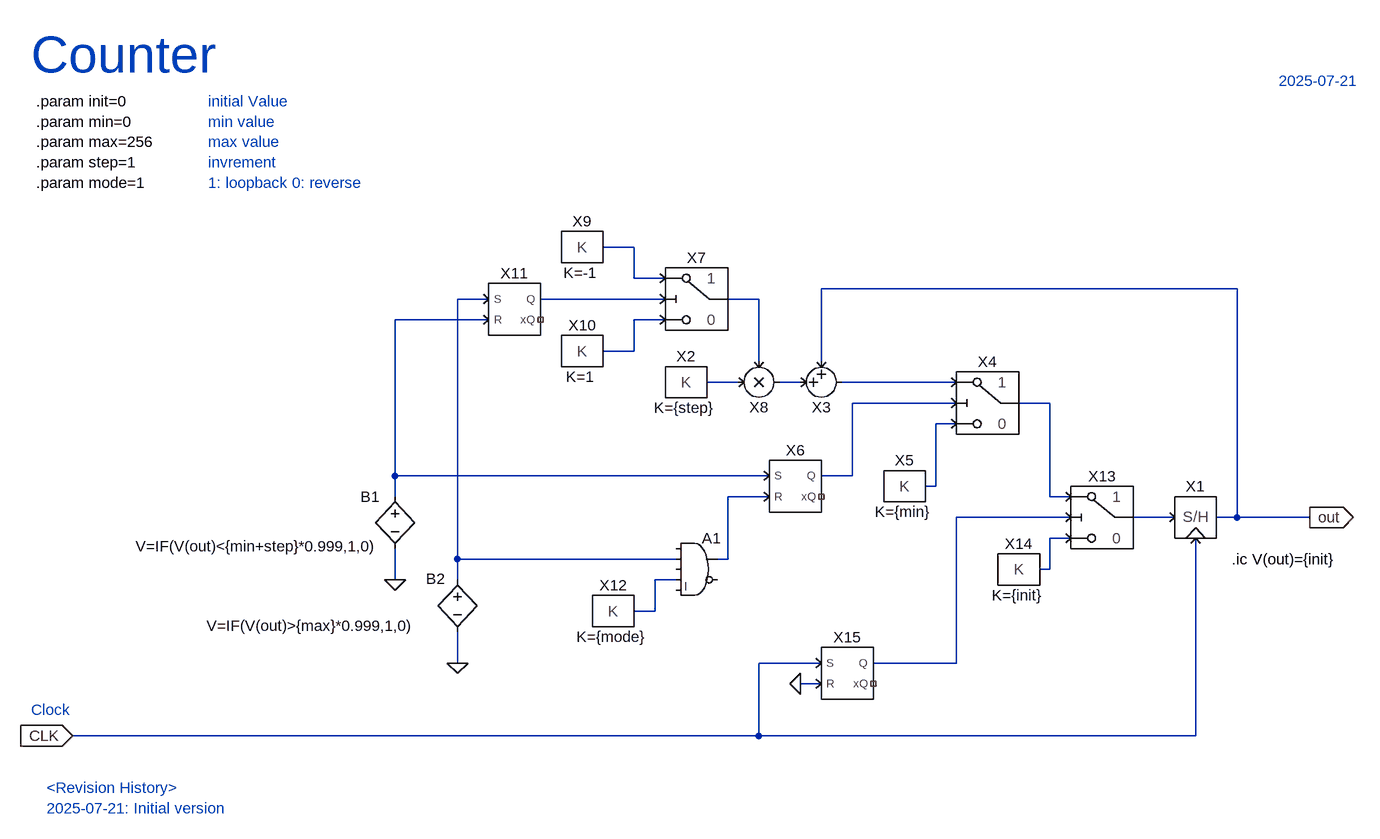
[diagram p0: schematic COUNTER.asc]
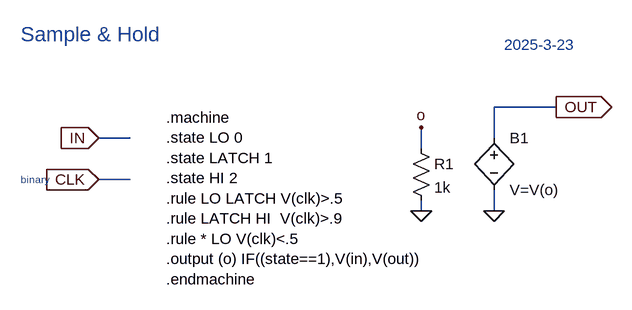
[diagram p1: sub-circuit samplehold.asc]
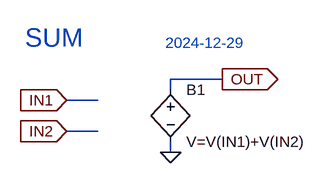
[diagram p2: sub-circuit sum.asc]
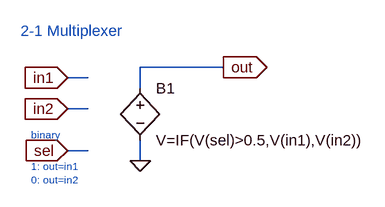
[diagram p3: sub-circuit mux.asc]
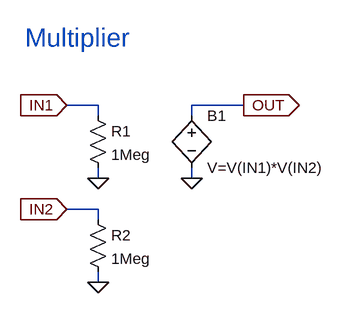
[diagram p4: sub-circuit mul.asc]
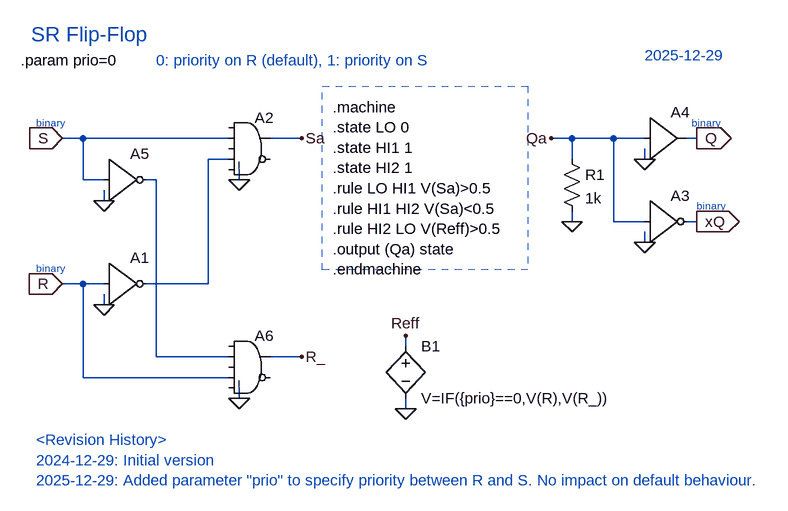
[diagram p5: sub-circuit srff.asc]
COUNTER.asc, the LTspice schematic file:
Version 4.1
SHEET 1 2588 2296
WIRE 160 304 112 304
WIRE 160 352 160 304
WIRE 208 352 160 352
WIRE 1088 368 448 368
WIRE -64 384 -112 384
WIRE 208 384 16 384
WIRE 352 384 304 384
WIRE -64 416 -208 416
WIRE 208 416 160 416
WIRE 160 464 160 416
WIRE 160 464 112 464
WIRE 352 480 352 384
WIRE 448 480 448 368
WIRE 320 512 272 512
WIRE 416 512 384 512
WIRE 656 512 480 512
WIRE 656 544 496 544
WIRE 800 544 752 544
WIRE 656 576 624 576
WIRE -208 656 -208 416
WIRE 368 656 -208 656
WIRE 496 656 496 544
WIRE 496 656 448 656
WIRE 624 672 624 576
WIRE 624 672 608 672
WIRE -208 688 -208 656
WIRE 368 688 304 688
WIRE 800 688 800 544
WIRE 832 688 800 688
WIRE 832 720 656 720
WIRE 992 720 928 720
WIRE 1088 720 1088 368
WIRE 1088 720 1056 720
WIRE 1200 720 1088 720
WIRE 832 752 800 752
WIRE -112 784 -112 384
WIRE 224 784 -112 784
WIRE 304 784 304 688
WIRE 304 784 288 784
WIRE 800 800 800 752
WIRE 800 800 784 800
WIRE -208 816 -208 768
WIRE -112 816 -112 784
WIRE 224 816 192 816
WIRE 192 864 192 816
WIRE 192 864 160 864
WIRE -112 944 -112 896
WIRE 448 944 352 944
WIRE 656 944 656 720
WIRE 656 944 528 944
WIRE 448 976 416 976
WIRE 352 1056 352 944
WIRE 352 1056 -704 1056
WIRE 1024 1056 1024 752
WIRE 1024 1056 352 1056
FLAG -704 1056 CLK
IOPIN -704 1056 In
FLAG 1200 720 out
IOPIN 1200 720 Out
FLAG -208 816 0
FLAG -112 944 0
FLAG 416 976 0
SYMBOL SAMPLEHOLD 1024 720 R0
SYMATTR InstName X1
SYMBOL CONST 240 512 R0
WINDOW 39 -3 55 Bottom 2
SYMATTR SpiceLine K={step}
SYMATTR InstName X2
SYMBOL SUM 448 512 M180
SYMATTR InstName X3
SYMBOL MUX 704 544 R0
SYMATTR InstName X4
SYMBOL CONST 576 672 R0
WINDOW 39 -3 55 Bottom 2
SYMATTR SpiceLine K={min}
SYMATTR InstName X5
SYMBOL bv -208 672 M0
WINDOW 3 25 92 Left 2
SYMATTR Value V=IF(V(out)<{min+step}*0.999,1,0)
SYMATTR InstName B1
SYMBOL bv -112 800 R0
WINDOW 0 -48 14 Left 2
WINDOW 3 -386 87 Left 2
SYMATTR InstName B2
SYMATTR Value V=IF(V(out)>{max}*0.999,1,0)
SYMBOL MUX 256 384 R0
SYMATTR InstName X7
SYMBOL MUL 352 512 M180
SYMATTR InstName X8
SYMBOL CONST 80 304 R0
WINDOW 39 -3 55 Bottom 2
SYMATTR SpiceLine K=-1
SYMATTR InstName X9
SYMBOL CONST 80 464 R0
WINDOW 39 -3 55 Bottom 2
SYMATTR InstName X10
SYMBOL SRFF -32 400 R0
SYMATTR InstName X11
SYMBOL SRFF 400 672 R0
SYMATTR InstName X6
SYMBOL Digital\\and 256 736 R0
SYMATTR InstName A1
SYMBOL CONST 128 864 R0
WINDOW 39 -3 55 Bottom 2
SYMATTR SpiceLine K={mode}
SYMATTR InstName X12
SYMBOL MUX 880 720 R0
SYMATTR InstName X13
SYMBOL CONST 752 800 R0
WINDOW 39 -3 55 Bottom 2
SYMATTR SpiceLine K={init}
SYMATTR InstName X14
SYMBOL SRFF 480 960 R0
SYMATTR InstName X15
TEXT -760 80 Left 2 !.param init=0\n.param min=0\n.param max=256\n.param step=1\n.param mode=1
TEXT -768 8 Left 6 ;Counter
TEXT 1152 48 Left 2 ;2025-07-21
TEXT 1080 784 Left 2 !.ic V(out)={init}
TEXT -496 80 Left 2 ;initial Value\nmin value\nmax value\ninvrement\n1: loopback 0: reverse
TEXT -768 1016 Left 2 ;Clock
TEXT -744 1136 Left 2 ;<Revision History>\n2025-07-21: Initial version

samplehold.asc, the sub-circuit schematic file:
Version 4
SHEET 1 880 680
WIRE 576 -560 480 -560
WIRE -80 -512 -128 -512
WIRE 480 -512 480 -560
WIRE 368 -496 368 -528
WIRE -80 -448 -128 -448
WIRE 368 -400 368 -416
WIRE 480 -400 480 -432
FLAG -128 -512 IN
IOPIN -128 -512 In
FLAG -128 -448 CLK
IOPIN -128 -448 In
FLAG 576 -560 OUT
IOPIN 576 -560 Out
FLAG 368 -400 0
FLAG 368 -528 o
FLAG 480 -400 0
SYMBOL res 352 -512 R0
SYMATTR InstName R1
SYMATTR Value 1k
SYMBOL bv 480 -528 R0
SYMATTR InstName B1
SYMATTR Value V=V(o)
TEXT -248 -672 Left 3 ;Sample & Hold
TEXT -248 -448 Left 1 ;binary
TEXT 496 -656 Left 2 ;2025-3-23
TEXT -24 -544 Left 2 !.machine\n.state LO 0\n.state LATCH 1\n.state HI 2\n.rule LO LATCH V(clk)>.5\n.rule LATCH HI  V(clk)>.9\n.rule * LO V(clk)<.5\n.output (o) IF((state==1),V(in),V(out))  \n.endmachine

sum.asc, the sub-circuit schematic file:
Version 4
SHEET 1 880 680
WIRE 288 96 208 96
WIRE 208 112 208 96
WIRE 96 128 48 128
WIRE 96 176 48 176
WIRE 208 208 208 192
FLAG 48 128 IN1
IOPIN 48 128 In
FLAG 48 176 IN2
IOPIN 48 176 In
FLAG 208 208 0
FLAG 288 96 OUT
IOPIN 288 96 Out
SYMBOL bv 208 96 R0
SYMATTR InstName B1
SYMATTR Value V=V(IN1)+V(IN2)
TEXT -16 32 Left 4 ;SUM
TEXT 200 40 Left 2 ;2024-12-29

mux.asc, the sub-circuit schematic file:
Version 4
SHEET 1 880 680
WIRE 336 16 208 16
WIRE 128 32 96 32
WIRE 208 48 208 16
WIRE 128 80 96 80
WIRE 128 144 96 144
WIRE 208 160 208 128
FLAG 96 32 in1
IOPIN 96 32 In
FLAG 96 80 in2
IOPIN 96 80 In
FLAG 96 144 sel
IOPIN 96 144 In
FLAG 336 16 out
IOPIN 336 16 Out
FLAG 208 160 0
SYMBOL bv 208 32 R0
SYMATTR InstName B1
SYMATTR Value V=IF(V(sel)>0.5,V(in1),V(in2))
TEXT 24 -40 Left 2 ;2-1 Multiplexer
TEXT 40 120 Left 1 ;binary
TEXT 40 168 Left 1 ;1: out=in1\n0: out=in2

mul.asc, the sub-circuit schematic file:
Version 4
SHEET 1 880 680
WIRE 96 48 48 48
WIRE 320 48 240 48
WIRE 96 64 96 48
WIRE 240 64 240 48
WIRE 96 160 96 144
WIRE 240 160 240 144
WIRE 96 208 48 208
WIRE 96 224 96 208
WIRE 96 320 96 304
FLAG 48 48 IN1
IOPIN 48 48 In
FLAG 48 208 IN2
IOPIN 48 208 In
FLAG 240 160 0
FLAG 320 48 OUT
IOPIN 320 48 Out
FLAG 96 160 0
FLAG 96 320 0
SYMBOL bv 240 48 R0
SYMATTR InstName B1
SYMATTR Value V=V(IN1)*V(IN2)
SYMBOL res 80 48 R0
SYMATTR InstName R1
SYMATTR Value 1Meg
SYMBOL res 80 208 R0
SYMATTR InstName R2
SYMATTR Value 1Meg
TEXT -16 -56 Left 4 ;Multiplier

srff.asc, the sub-circuit schematic file:
Version 4.1
SHEET 1 928 680
WIRE -272 -496 -304 -496
WIRE -48 -496 -272 -496
WIRE 64 -496 16 -496
WIRE 480 -496 448 -496
WIRE 544 -496 480 -496
WIRE 592 -496 544 -496
WIRE 672 -496 656 -496
WIRE -48 -464 -80 -464
WIRE 480 -464 480 -496
WIRE 592 -464 592 -480
WIRE -272 -432 -272 -496
WIRE -240 -432 -272 -432
WIRE -160 -432 -176 -432
WIRE -32 -432 -32 -448
WIRE -240 -400 -240 -416
WIRE 480 -368 480 -384
WIRE 544 -368 544 -496
WIRE 592 -368 544 -368
WIRE 672 -368 656 -368
WIRE 592 -336 592 -352
WIRE -272 -272 -304 -272
WIRE -240 -272 -272 -272
WIRE -80 -272 -80 -464
WIRE -80 -272 -176 -272
WIRE -240 -240 -240 -256
WIRE 224 -176 224 -192
WIRE -160 -160 -160 -432
WIRE -48 -160 -160 -160
WIRE 64 -160 16 -160
WIRE -272 -128 -272 -272
WIRE -48 -128 -272 -128
WIRE -32 -96 -32 -112
WIRE 224 -80 224 -96
FLAG -304 -496 S
IOPIN -304 -496 In
FLAG -304 -272 R
IOPIN -304 -272 In
FLAG -240 -240 0
FLAG -32 -432 0
FLAG 64 -496 Sa
FLAG 592 -336 0
FLAG 672 -496 Q
IOPIN 672 -496 Out
FLAG 672 -368 xQ
IOPIN 672 -368 Out
FLAG 592 -464 0
FLAG 448 -496 Qa
FLAG 480 -368 0
FLAG 224 -80 0
FLAG 224 -192 Reff
FLAG -240 -400 0
FLAG -32 -96 0
FLAG 64 -160 R_
SYMBOL Digital\\inv -240 -336 R0
SYMATTR InstName A1
SYMBOL Digital\\and -16 -544 R0
SYMATTR InstName A2
SYMBOL Digital\\inv 592 -432 R0
SYMATTR InstName A3
SYMBOL Digital\\buf1 592 -560 R0
SYMATTR InstName A4
SYMBOL res 464 -480 R0
SYMATTR InstName R1
SYMATTR Value 1k
SYMBOL bv 224 -192 R0
SYMATTR InstName B1
SYMATTR Value V=IF({prio}==0,V(R),V(R_))
SYMBOL Digital\\inv -240 -496 R0
SYMATTR InstName A5
SYMBOL Digital\\and -16 -208 R0
SYMATTR InstName A6
TEXT 112 -544 Left 2 !.machine\n.state LO 0\n.state HI1 1\n.state HI2 1\n.rule LO HI1 V(Sa)>0.5\n.rule HI1 HI2 V(Sa)<0.5\n.rule HI2 LO V(Reff)>0.5\n.output (Qa) state\n.endmachine
TEXT -352 -656 Left 3 ;SR Flip-Flop
TEXT -344 -520 Left 1 ;binary
TEXT -344 -296 Left 1 ;binary
TEXT 664 -520 Left 1 ;binary
TEXT 672 -392 Left 1 ;binary
TEXT 592 -624 Left 2 ;2025-12-29
TEXT -368 -616 Left 2 !.param prio=0
TEXT -160 -616 Left 2 ;0: priority on R (default), 1: priority on S
TEXT -344 -32 Left 2 ;<Revision History>\n2024-12-29: Initial version\n2025-12-29: Added parameter "prio" to specify priority between R and S. No impact on default behaviour.
RECTANGLE Normal 412 -294 96 -576 2

The netlist it stands for:
* COUNTER.asc
X§X1 CLK N015 out samplehold
X§X2 N007 CONST K={step}  ; pins K
X§X3 N008 out N009 sum
X§X4 N009 N012 N010 N011 mux
X§X5 N012 CONST K={min}  ; pins K
B1 N005 0 V=IF(V(out)<{min+step}*0.999,1,0)
B2 N002 0 V=IF(V(out)>{max}*0.999,1,0)
X§X7 N001 N006 N003 N004 mux
X§X8 N007 N004 N008 mul
X§X9 N001 CONST K=-1  ; pins K
X§X10 N006 CONST K=1  ; pins K
X§X11 N005 N002 N003 NC_01 srff params: prio=0
X§X6 N013 N005 N010 NC_02 srff params: prio=0
A1 0 N002 0 N017 0 0 N013 0 AND
X§X12 N017 CONST K={mode}  ; pins K
X§X13 N011 N016 N014 N015 mux
X§X14 N016 CONST K={init}  ; pins K
X§X15 0 CLK N014 NC_03 srff params: prio=0

* block symbol definitions
.subckt samplehold CLK IN OUT
R1 o 0 1k
B1 OUT 0 V=V(o)
* Sample & Hold
* binary
* 2025-3-23
.machine
.state LO 0
.state LATCH 1
.state HI 2
.rule LO LATCH V(clk)>.5
.rule LATCH HI  V(clk)>.9
.rule * LO V(clk)<.5
.output (o) IF((state==1),V(in),V(out))
.endmachine
.ends samplehold

.subckt sum in1 in2 out
B1 OUT 0 V=V(IN1)+V(IN2)
* SUM
* 2024-12-29
.ends sum

.subckt mux in1 in2 sel out
B1 out 0 V=IF(V(sel)>0.5,V(in1),V(in2))
* 2-1 Multiplexer
* binary
* 1: out=in1
* 0: out=in2
.ends mux

.subckt mul in1 in2 out
B1 OUT 0 V=V(IN1)*V(IN2)
R1 IN1 0 1Meg
R2 IN2 0 1Meg
* Multiplier
.ends mul

.subckt srff R S Q xQ
A1 R 0 0 0 0 N001 0 0 BUF
A2 0 S 0 N001 0 0 Sa 0 AND
A3 Qa 0 0 0 0 xQ 0 0 BUF
A4 Qa 0 0 0 0 0 Q 0 BUF
R1 Qa 0 1k
B1 Reff 0 V=IF({prio}==0,V(R),V(R_))
A5 S 0 0 0 0 N002 0 0 BUF
A6 0 N002 0 R 0 0 R_ 0 AND
.machine
.state LO 0
.state HI1 1
.state HI2 1
.rule LO HI1 V(Sa)>0.5
.rule HI1 HI2 V(Sa)<0.5
.rule HI2 LO V(Reff)>0.5
.output (Qa) state
.endmachine
* SR Flip-Flop
* binary
* binary
* binary
* binary
* 2025-12-29
.param prio=0
* 0: priority on R (default), 1: priority on S
* <Revision History>
* 2024-12-29: Initial version
* 2025-12-29: Added parameter "prio" to specify priority between R and S. No impact on default behaviour.
.ends srff

.param init=0
.param min=0
.param max=256
.param step=1
.param mode=1
* Counter
* 2025-07-21
.ic V(out)={init}
* initial Value
* min value
* max value
* invrement
* 1: loopback 0: reverse
* Clock
* <Revision History>
* 2025-07-21: Initial version
.backanno
.end